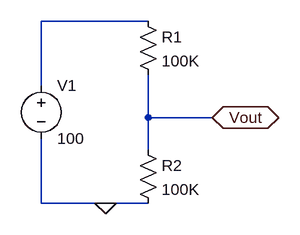
[diagram p0: schematic resistive_divider.asc]
resistive_divider.asc, the LTspice schematic file:
Version 4
SHEET 1 880 680
WIRE 192 160 32 160
WIRE 32 256 32 160
WIRE 192 304 192 240
WIRE 288 304 192 304
WIRE 192 352 192 304
WIRE 32 432 32 336
WIRE 128 432 32 432
WIRE 192 432 128 432
FLAG 128 432 0
FLAG 288 304 Vout
IOPIN 288 304 BiDir
SYMBOL res 176 144 R0
SYMATTR InstName R1
SYMATTR Value 100K
SYMBOL res 176 336 R0
SYMATTR InstName R2
SYMATTR Value 100K
SYMBOL voltage 32 240 R0
SYMATTR InstName V1
SYMATTR Value 100
SYMATTR SpiceLine Rser=0

The netlist it stands for:
* resistive_divider.asc
R1 N001 Vout 100K
R2 Vout 0 100K
V1 N001 0 100 Rser=0
.backanno
.end